# EAGLE design 8_Channel_Current_Sensor (EAGLE 8.7.1)
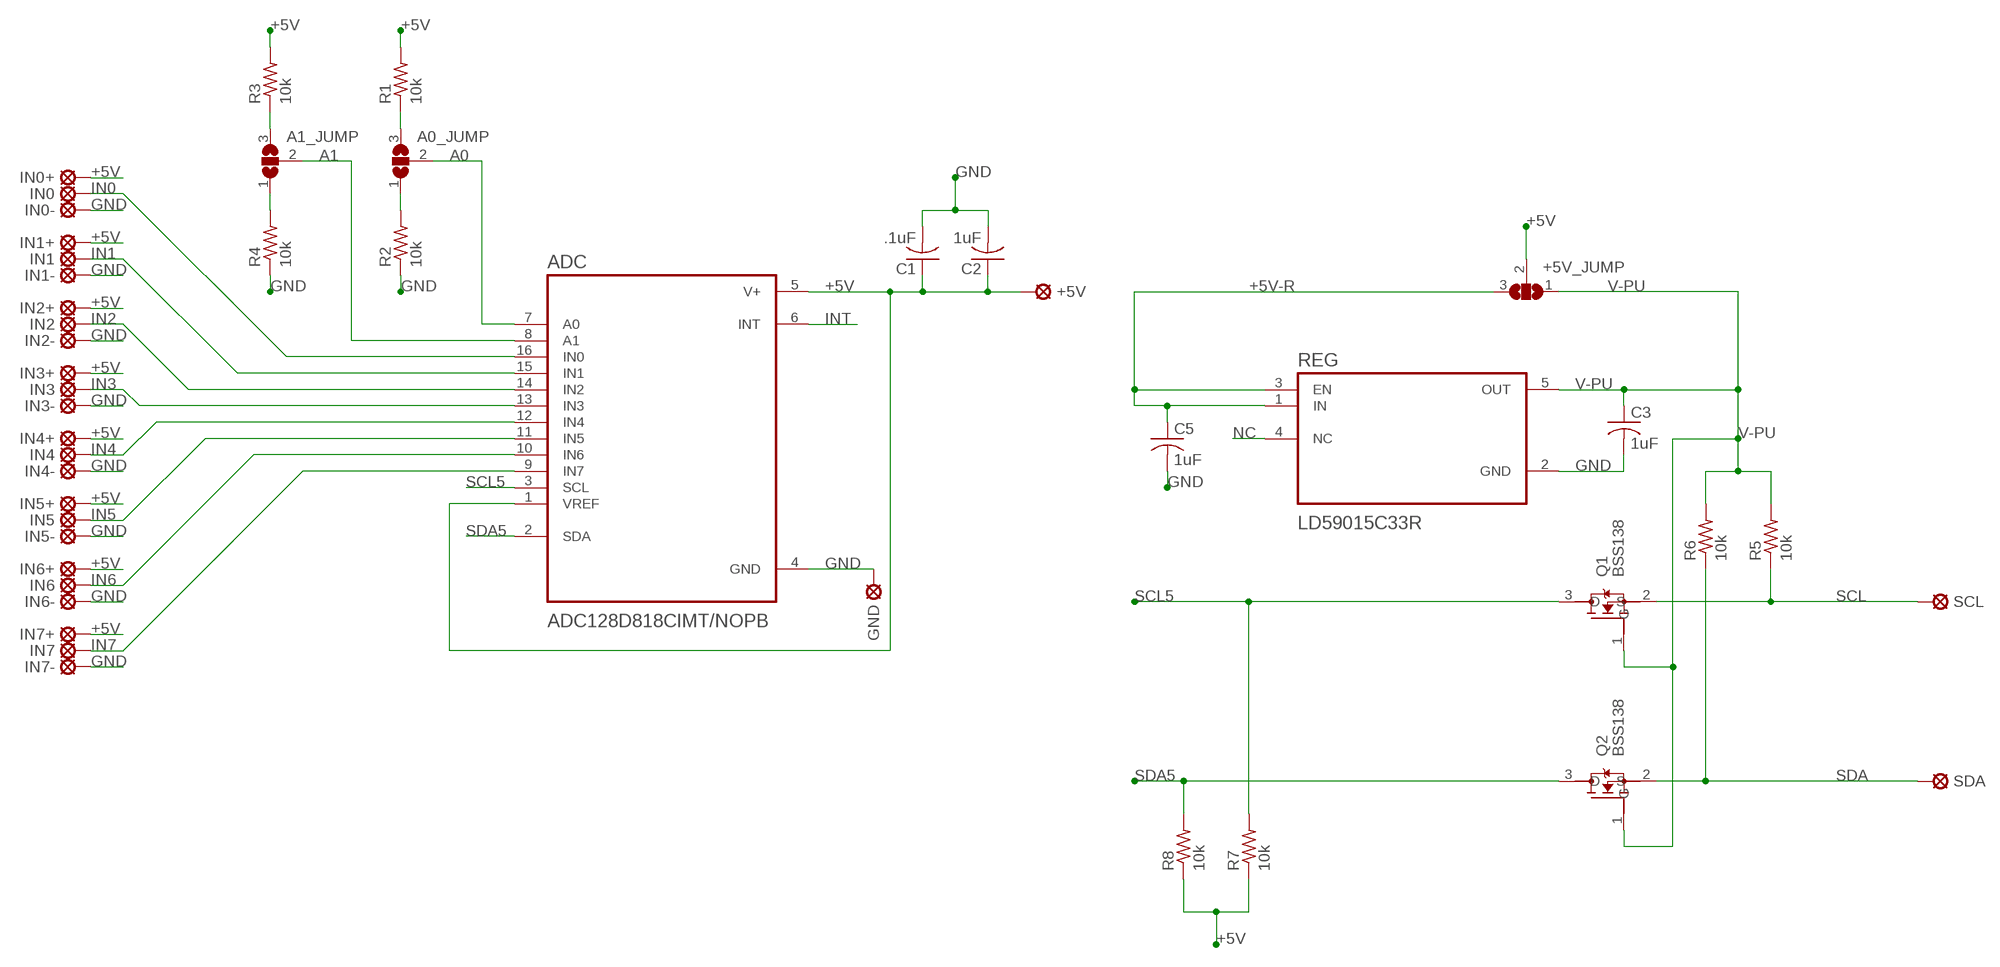
[diagram p0: schematic, sheet 1]

## Parts
+5V  LSP10  [LSP10]
+5V_JUMP  SJ2W  [SJ_2]
A0_JUMP  SJ2W  [SJ_2]
A1_JUMP  SJ2W  [SJ_2]
ADC  ADC128D818CIMT/NOPB  [SOP65P640X120-16N]
C1  .1uF  C-USC0603  [C0603]
C2  1uF  C-USC0603  [C0603]
C3  1uF  C-USC0603  [C0603]
C5  1uF  C-USC0603  [C0603]
GND  LSP10  [LSP10]
IN0  LSP10  [LSP10]
IN0+  LSP10  [LSP10]
IN0-  LSP10  [LSP10]
IN1  LSP10  [LSP10]
IN1+  LSP10  [LSP10]
IN1-  LSP10  [LSP10]
IN2  LSP10  [LSP10]
IN2+  LSP10  [LSP10]
IN2-  LSP10  [LSP10]
IN3  LSP10  [LSP10]
IN3+  LSP10  [LSP10]
IN3-  LSP10  [LSP10]
IN4  LSP10  [LSP10]
IN4+  LSP10  [LSP10]
IN4-  LSP10  [LSP10]
IN5  LSP10  [LSP10]
IN5+  LSP10  [LSP10]
IN5-  LSP10  [LSP10]
IN6  LSP10  [LSP10]
IN6+  LSP10  [LSP10]
IN6-  LSP10  [LSP10]
IN7  LSP10  [LSP10]
IN7+  LSP10  [LSP10]
IN7-  LSP10  [LSP10]
Q1  BSS138  [SOT95P240X120-3N]
Q2  BSS138  [SOT95P240X120-3N]
R1  10k  R-US_R0603  [R0603]
R2  10k  R-US_R0603  [R0603]
R3  10k  R-US_R0603  [R0603]
R4  10k  R-US_R0603  [R0603]
R5  10k  R-US_R0603  [R0603]
R6  10k  R-US_R0603  [R0603]
R7  10k  R-US_R0603  [R0603]
R8  10k  R-US_R0603  [R0603]
REG  LD59015C33R  [SOT65P210X110-5N]
SCL  LSP10  [LSP10]
SDA  LSP10  [LSP10]

## Nets
+5V: +5V.MP +5V_JUMP.2 ADC.1(VREF) ADC.5(V+) C1.1 C2.1 IN0+.MP IN1+.MP IN2+.MP IN3+.MP IN4+.MP IN5+.MP IN6+.MP IN7+.MP R1.2 R3.2 R7.1 R8.1
+5V-R: +5V_JUMP.3 C5.1 REG.1(IN) REG.3(EN)
A0: A0_JUMP.2 ADC.7(A0)
A1: A1_JUMP.2 ADC.8(A1)
GND: ADC.4(GND) C1.2 C2.2 C3.2 C5.2 GND.MP IN0-.MP IN1-.MP IN2-.MP IN3-.MP IN4-.MP IN5-.MP IN6-.MP IN7-.MP R2.1 R4.1 REG.2(GND)
IN0: ADC.16(IN0) IN0.MP
IN1: ADC.15(IN1) IN1.MP
IN2: ADC.14(IN2) IN2.MP
IN3: ADC.13(IN3) IN3.MP
IN4: ADC.12(IN4) IN4.MP
IN5: ADC.11(IN5) IN5.MP
IN6: ADC.10(IN6) IN6.MP
IN7: ADC.9(IN7) IN7.MP
INT: ADC.6(INT)
N$1: A1_JUMP.3 R3.1
N$2: A1_JUMP.1 R4.2
N$3: A0_JUMP.1 R2.2
N$4: A0_JUMP.3 R1.1
NC: REG.4(NC)
SCL: Q1.2(S) R5.1 SCL.MP
SCL5: ADC.3(SCL) Q1.3(D) R7.2
SDA: Q2.2(S) R6.1 SDA.MP
SDA5: ADC.2(SDA) Q2.3(D) R8.2
V-PU: +5V_JUMP.1 C3.1 Q1.1(G) Q2.1(G) R5.2 R6.2 REG.5(OUT)

## Library data of the parts
+5V GND IN0 IN0+ IN0- IN1 IN1+ IN1- IN2 IN2+ IN2- IN3 IN3+ IN3- IN4 IN4+ IN4- IN5 IN5+ IN5- IN6 IN6+ IN6- IN7 IN7+ IN7- SCL SDA = solpad:LSP10: SOLDER PAD drill 1.0 mm, distributor Buerklin, 12H555
+5V_JUMP A0_JUMP A1_JUMP = jumper:SJ2W: SMD solder JUMPER
ADC = ADC128D818CIMT_NOPB:ADC128D818CIMT/NOPB: None; AVAILABILITY: Good; DESCRIPTION: 12-Bit, 8-Channel, ADC System Monitor w/ Temp Sensor, Internal/External Reference, & I2C Interface 16-TSSOP -40 to 125; MF: Texas Instruments; MP: ADC128D818CIMT/NOPB; PACKAGE: TSSOP-16 Texas Instruments; PRICE: 3.94 USD
C1-C3 C5 = resistor:C-US: CAPACITOR, American symbol
Q1 Q2 = BSS138:BSS138: B138 Series 50 V 6 Ohms N-Ch Logic Level Enhancement Mode FET - SOT-23-3; AVAILABILITY: Good; DESCRIPTION: 50V N-Channel Logic Level Enhancement Mode Field Effect Transistor; MF: ON Semiconductor; MP: BSS138; PACKAGE: SOT-23 ON Semiconductor; PRICE: 0.09 USD
R1-R8 = resistor:R-US_: RESISTOR, American symbol
REG = LD59015C33R:LD59015C33R: None; AVAILABILITY: Good; DESCRIPTION: LD59015 Series 150 mA 3.3 V Fixed High PSRR LDO Voltage Regulator - SOT-323-5; MF: STMicroelectronics; MP: LD59015C33R; PACKAGE: SOT-323 STMicroelectronics; PRICE: 0.44 USD

## Board
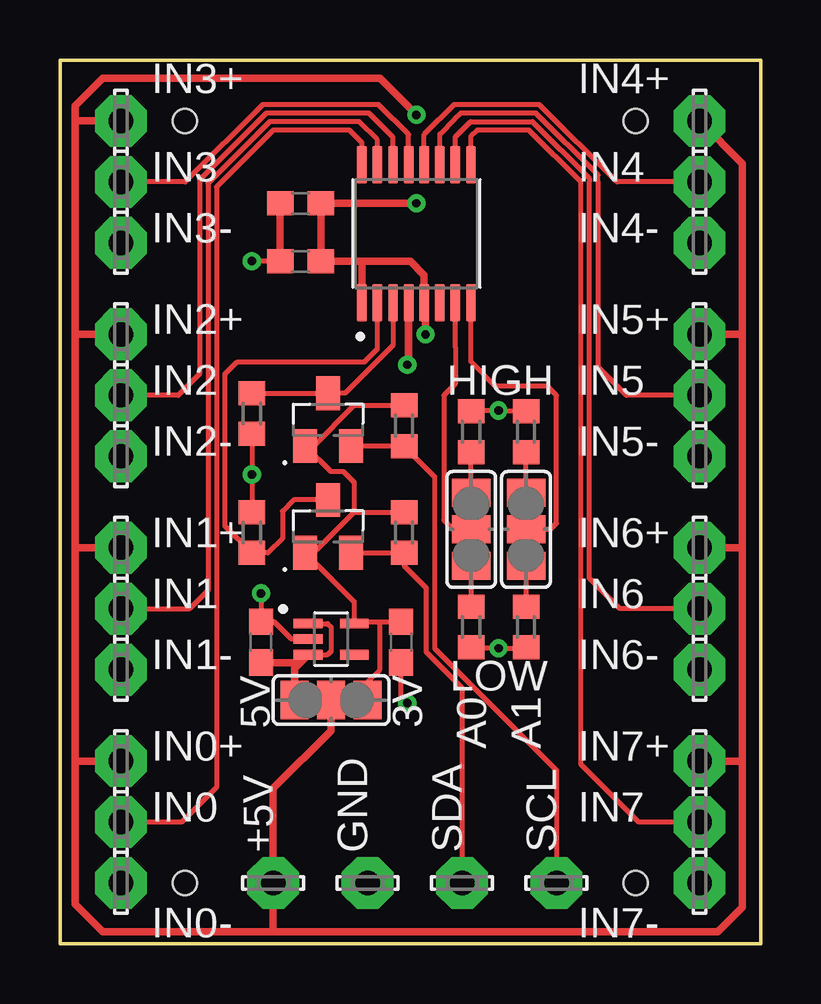
[diagram p1: board, top side]
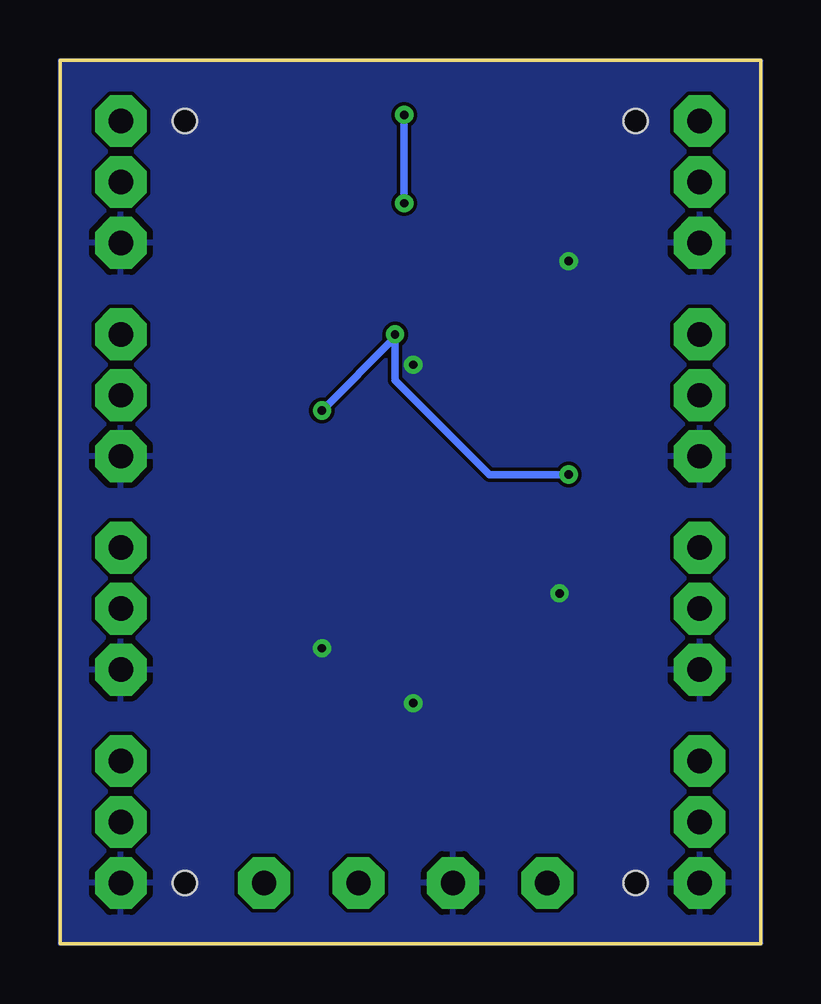
[diagram p2: board, bottom side, seen from below]

Size 29.21 x 36.83 mm. Coordinates in mm from the lower left corner, seen from the top.
Outline: 0,0 0,36.83 29.21,36.83 29.21,0 0,0
Copper layers (1*16): Top 0.035mm / dielectric 1.5mm / Bottom 0.035mm
Design rules "default *": minimum track width 6mil, minimum drill 0.35mm, track to track 6mil, track to pad 6mil, pad to pad 6mil, via to via 6mil, smd to smd 6mil, copper to edge 0mil, drill to drill 6mil, minimum pad ring 10mil, minimum via ring 8mil, stop-mask expansion 4mil, vias tented up to drill 0mil, thermal gap 10mil
Holes 1 mm at 5.21,2.54 24,2.54 5.21,34.29 24,34.29

### Footprints (pad centres in the part's own frame; a part is rotated, then mirrored left to right if it is on the bottom)
LSP10 = drill 1.016 pad 2.159 octagon: MP 0,0
SJ_2 = smd 1.168 x 1.6: 1 -1.524,0; 2 0,0; 3 1.524,0
SOP65P640X120-16N = smd 1.57 x 0.41: 1 -2.87,2.275; 2 -2.87,1.625; 3 -2.87,0.975; 4 -2.87,0.325; 5 -2.87,-0.325; 6 -2.87,-0.975; 7 -2.87,-1.625; 8 -2.87,-2.275; 9 2.87,-2.275; 10 2.87,-1.625; 11 2.87,-0.975; 12 2.87,-0.325; 13 2.87,0.325; 14 2.87,0.975; 15 2.87,1.625; 16 2.87,2.275
C0603 = smd 1.1 x 1: 1 -0.85,0; 2 0.85,0
SOT95P240X120-3N = smd 1 x 1.4: 1 -0.95,-1.1; 2 0.95,-1.1; 3 0,1.1
R0603 = smd 1 x 1.1: 1 -0.85,0; 2 0.85,0
SOT65P210X110-5N = smd 0.4 x 1.19: 1 -0.65,-0.96; 2 0,-0.96; 3 0.65,-0.96; 4 0.65,0.96; 5 -0.65,0.96

### Placement (x,y rotation side)
+5V  8.89,2.54 0 top
+5V_JUMP  11.3,10.16 180 top
A0_JUMP  17.14,17.27 90 top
A1_JUMP  19.43,17.27 90 top
ADC  14.86,29.59 90 top
C1  10.03,30.86 180 top
C2  10.03,28.45 180 top
C3  14.22,12.57 270 top
C5  8.38,12.57 90 top
GND  12.83,2.54 0 top
IN0  2.54,5.08 90 top
IN0+  2.54,7.62 90 top
IN0-  2.54,2.54 90 top
IN1  2.54,13.97 90 top
IN1+  2.54,16.51 90 top
IN1-  2.54,11.43 90 top
IN2  2.54,22.86 90 top
IN2+  2.54,25.4 90 top
IN2-  2.54,20.32 90 top
IN3  2.54,31.75 90 top
IN3+  2.54,34.29 90 top
IN3-  2.54,29.21 90 top
IN4  26.67,31.75 270 top
IN4+  26.67,34.29 270 top
IN4-  26.67,29.21 270 top
IN5  26.67,22.86 270 top
IN5+  26.67,25.4 270 top
IN5-  26.67,20.32 270 top
IN6  26.67,13.97 270 top
IN6+  26.67,16.51 270 top
IN6-  26.67,11.43 270 top
IN7  26.67,5.08 270 top
IN7+  26.67,7.62 270 top
IN7-  26.67,2.54 270 top
Q1  11.18,21.84 0 top
Q2  11.18,17.4 0 top
R1  17.14,21.34 90 top
R2  17.14,13.21 90 top
R3  19.43,21.34 90 top
R4  19.43,13.21 90 top
R5  14.35,21.59 90 top
R6  14.35,17.14 90 top
R7  8,22.1 90 top
R8  8,17.14 270 top
REG  11.3,12.7 270 top
SCL  20.7,2.54 0 top
SDA  16.76,2.54 0 top

### Tracks (layer width: path | path; a pad name or v marks a point on that pad's centre or on a via)
+5V  (via drill 0.35)
  Top 0.203: R7.1 v8,19.56 R8.1 | R1.2 17.18,22.23 v18.29,22.23 19.39,22.23 R3.2
  Top 0.305: IN4+.MP 28.45,32.51 28.45,25.4 | ADC.1 12.58,28.44 | 12.58,28.44 12.57,28.45 14.61,28.45 15.18,27.87 ADC.5 15.24,26.66 v15.24,25.4 | v14.86,34.54 13.34,36.07 1.78,36.07 0.64,34.92 0.64,34.29 | 8.89,0.51 1.78,0.51 0.64,1.65 0.64,7.62 | 8.89,0.51 27.43,0.51 28.45,1.52 28.45,7.62 | 0.64,7.62 0.64,16.51 | 0.64,16.51 0.64,25.4 | 0.64,25.4 0.64,34.29 | IN0+.MP 0.64,7.62 | IN1+.MP 0.64,16.51 | IN2+.MP 0.64,25.4 | IN3+.MP 0.64,34.29 | 28.45,7.62 28.45,16.51 | 28.45,16.51 28.45,25.4 | IN7+.MP 28.45,7.62 | IN6+.MP 28.45,16.51 | IN5+.MP 28.45,25.4 | v14.86,30.86 C1.1 C2.1 10.89,28.44 12.58,28.44 | 8.89,0.51 +5V.MP 8.89,6.48 11.3,8.89 +5V_JUMP.2
  Bottom 0.305: v14.86,34.54 v14.86,30.86 | v18.29,22.23 15.24,25.27 | 15.24,25.27 v15.24,25.4 | v8,19.56 11.3,19.56 15.24,23.5 15.24,25.27
+5V-R
  Top 0.203: REG.3 11.16,12.05 11.3,12.19 11.3,13.21 11.16,13.35 REG.1 10.27,13.42
  Top 0.305: C5.1 10.02,11.72 | 10.02,11.72 REG.3 | +5V_JUMP.3 9.78,11.49 10.02,11.72
A0
  Top 0.203: A0_JUMP.2 16.38,17.27 16,17.65 16,22.86 16.48,23.34 16.48,24.87 16.48,25.4 ADC.7
A1
  Top 0.203: A1_JUMP.2 20.45,17.27 20.7,17.53 20.7,22.86 20.32,23.24 18.16,23.24 17.13,24.27 ADC.8
GND  (via drill 0.35)
  Top 0.203: R4.1 19.39,12.32 v18.29,12.32 17.18,12.32 R2.1 | v14.48,10.03 14.22,10.29 C3.2 | v8.38,14.61 C5.2 8.93,13.42 9.65,12.7 REG.2 | C2.2 v8,28.45
  Top 0.305: C1.2 C2.2 | ADC.4 14.53,24.19 v14.48,24.13
  pour Bottom: 0,36.83 0,0 29.21,0 29.21,36.83
IN0
  Top 0.203: IN0.MP 5.08,5.08 6.53,6.53 6.53,31.55 8.89,33.91 12.06,33.91 12.58,33.39 ADC.16
IN1
  Top 0.203: IN1.MP 5.41,13.97 6.17,14.73 6.17,31.69 8.74,34.27 12.47,34.27 13.23,33.5 ADC.15
IN2
  Top 0.203: ADC.14 13.88,33.61 12.88,34.62 8.6,34.62 5.82,31.84 5.82,23.75 4.93,22.86 IN2.MP
IN3
  Top 0.203: ADC.13 14.53,33.73 13.28,34.98 8.45,34.98 5.22,31.75 IN3.MP
IN4
  Top 0.203: ADC.12 15.18,33.73 16.43,34.98 20,34.98 23.23,31.75 IN4.MP
IN5
  Top 0.203: IN5.MP 23.62,22.86 22.43,24.05 22.43,31.75 22.43,32.05 19.85,34.62 16.71,34.62 16.45,34.35 15.83,33.74 ADC.11
IN6
  Top 0.203: IN6.MP 23.34,13.97 22.07,15.24 22.07,31.75 22.07,31.9 19.7,34.27 17.12,34.27 16.48,33.63 ADC.10
IN7
  Top 0.203: IN7.MP 24.13,5.08 21.72,7.49 21.72,31.75 19.56,33.91 17.4,33.91 17.13,33.64 ADC.9
N$1
  Top 0.203: A1_JUMP.3 R3.1
N$2
  Top 0.203: A1_JUMP.1 R4.2
N$3
  Top 0.203: A0_JUMP.1 R2.2
N$4
  Top 0.203: A0_JUMP.3 R1.1
SCL
  Top 0.203: Q1.2 R5.1 15.62,19.47 15.62,12.32 20.7,7.24 SCL.MP
SCL5
  Top 0.203: R7.2 Q1.3 | Q1.3 | ADC.3 13.88,24.94 11.89,22.95 Q1.3
SDA
  Top 0.203: Q2.2 R6.1 14.35,15.75 15.27,14.83 15.27,12.17 16.76,10.67 SDA.MP
SDA5
  Top 0.203: Q2.3 9.74,18.5 9.27,18.03 9.27,16.89 8.68,16.3 R8.2 | 7.61,15.9 R8.2 | R8.2 6.88,17.41 6.88,23.75 7.39,24.26 12.7,24.26 13.23,24.79 ADC.2
V-PU
  Top 0.203: 12.26,18 10.57,16.3 Q2.1 12.26,14.26 REG.5 12.34,13.42 13.34,13.42 | 12.26,18 R6.2 | 14.44,22.35 R5.2 12.26,22.44 10.57,20.74 Q1.1 11.29,19.68 11.81,19.68 12.26,19.23 12.26,18 | 13.34,13.42 C3.1 | +5V_JUMP.1 12.83,10.92 13.34,11.43 13.34,13.42

### Text on the board
tNames: HIGH | 5V | LOW | 3V | A0 | A1